# EAGLE schematic J007017_RGB_IR (EAGLE 7.7.0), part 2 of 2
## Sheet 6 of 6
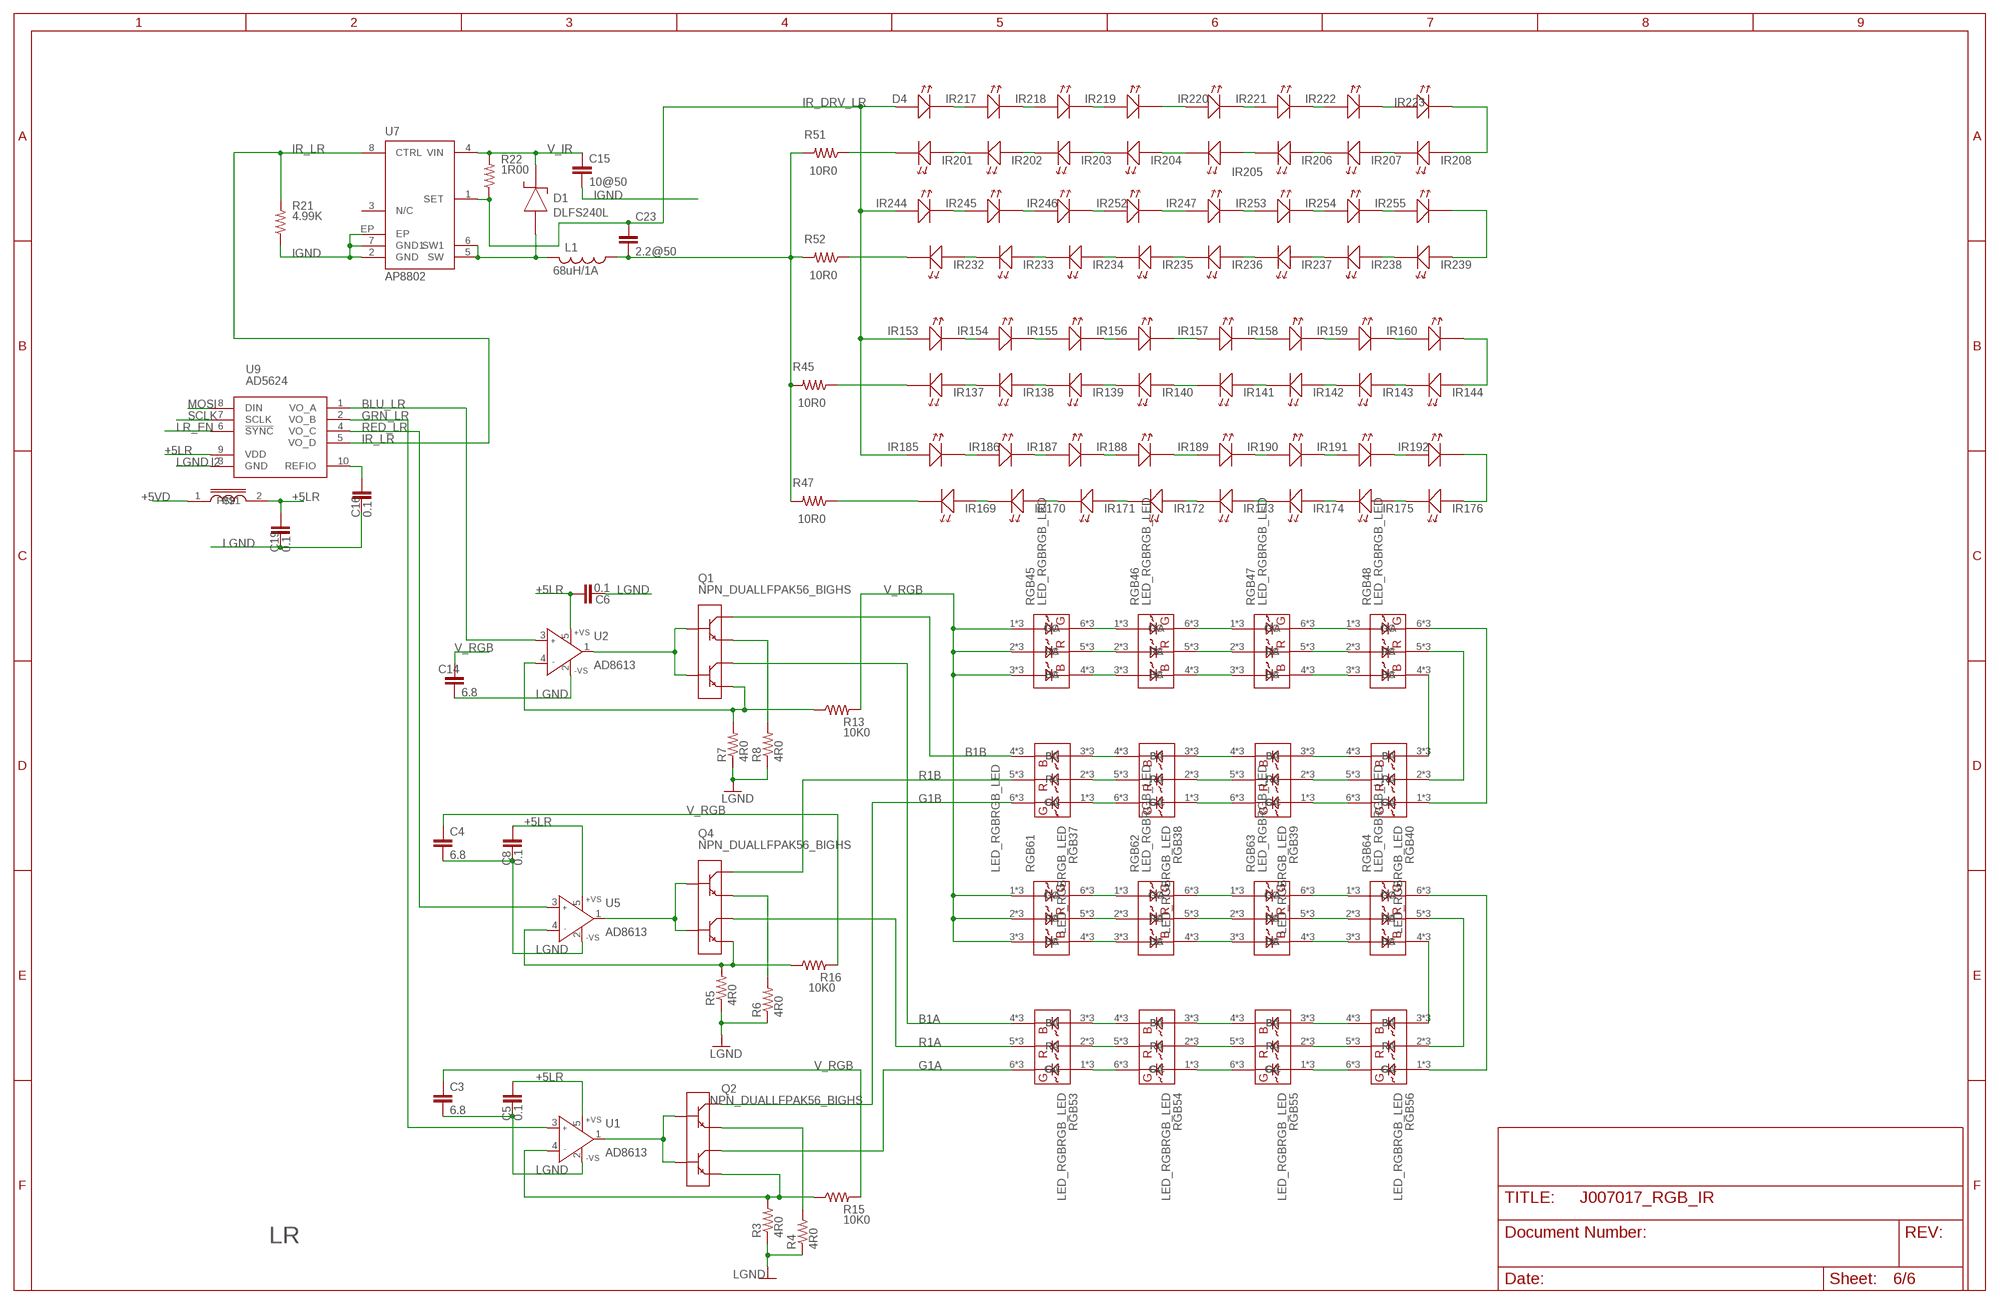
[diagram p3: schematic, sheet 6]

### Parts
C3  6.8  CAPS1210S  [1210S]
C4  6.8  CAPS1210S  [1210S]
C5  0.1  CAPS0603S  [0603S]
C6  0.1  CAPS0603S  [0603S]
C8  0.1  CAPS0603S  [0603S]
C14  6.8  CAPS1210S  [1210S]
C15  10@50  CAPS1210S  [1210S]
C16  0.1  CAPS0603S  [0603S]
C19  0.1  CAPS0603S  [0603S]
C23  2.2@50  CAPS1206S  [1206S]
D1  DLFS240L  DIODE_SCHOTTKYPWRDI-123  [PWRDI-123]
D4  LEDLED_SFH4050_HEAT  [LED_SFH4050_HEAT]
I2  INDUCTOR0805S  [0805S]
IR137  LEDLED_SFH4050  [LED_SFH4050]
IR138  LEDLED_SFH4050_HEAT  [LED_SFH4050_HEAT]
IR139  LEDLED_SFH4050_HEAT  [LED_SFH4050_HEAT]
IR140  LEDLED_SFH4050_HEAT  [LED_SFH4050_HEAT]
IR141  LEDLED_SFH4050_HEAT  [LED_SFH4050_HEAT]
IR142  LEDLED_SFH4050_HEAT  [LED_SFH4050_HEAT]
IR143  LEDLED_SFH4050_HEAT  [LED_SFH4050_HEAT]
IR144  LEDLED_SFH4050_HEAT  [LED_SFH4050_HEAT]
IR153  LEDLED_SFH4050_HEAT  [LED_SFH4050_HEAT]
IR154  LEDLED_SFH4050_A  [LED_SFH4045_HEAT_A]
IR155  LEDLED_SFH4050_HEAT  [LED_SFH4050_HEAT]
IR156  LEDLED_SFH4050_HEAT  [LED_SFH4050_HEAT]
IR157  LEDLED_SFH4050_HEAT  [LED_SFH4050_HEAT]
IR158  LEDLED_SFH4050_HEAT  [LED_SFH4050_HEAT]
IR159  LEDLED_SFH4050_HEAT  [LED_SFH4050_HEAT]
IR160  LEDLED_SFH4050_HEAT  [LED_SFH4050_HEAT]
IR169  LEDLED_SFH4050_HEAT  [LED_SFH4050_HEAT]
IR170  LEDLED_SFH4050_HEAT  [LED_SFH4050_HEAT]
IR171  LEDLED_SFH4050_HEAT  [LED_SFH4050_HEAT]
IR172  LEDLED_SFH4050_HEAT  [LED_SFH4050_HEAT]
IR173  LEDLED_SFH4050_HEAT  [LED_SFH4050_HEAT]
IR174  LEDLED_SFH4050_HEAT  [LED_SFH4050_HEAT]
IR175  LEDLED_SFH4050_HEAT  [LED_SFH4050_HEAT]
IR176  LEDLED_SFH4050_HEAT  [LED_SFH4050_HEAT]
IR185  LEDLED_SFH4050_HEAT  [LED_SFH4050_HEAT]
IR186  LEDLED_SFH4050_HEAT  [LED_SFH4050_HEAT]
IR187  LEDLED_SFH4050_HEAT  [LED_SFH4050_HEAT]
IR188  LEDLED_SFH4050_HEAT  [LED_SFH4050_HEAT]
IR189  LEDLED_SFH4050_HEAT  [LED_SFH4050_HEAT]
IR190  LEDLED_SFH4050_HEAT  [LED_SFH4050_HEAT]
IR191  LEDLED_SFH4050_HEAT  [LED_SFH4050_HEAT]
IR192  LEDLED_SFH4050_HEAT  [LED_SFH4050_HEAT]
IR201  LEDLED_SFH4050_HEAT  [LED_SFH4050_HEAT]
IR202  LEDLED_SFH4050_HEAT  [LED_SFH4050_HEAT]
IR203  LEDLED_SFH4050_HEAT  [LED_SFH4050_HEAT]
IR204  LEDLED_SFH4050_HEAT  [LED_SFH4050_HEAT]
IR205  LEDLED_SFH4050_HEAT  [LED_SFH4050_HEAT]
IR206  LEDLED_SFH4050_HEAT  [LED_SFH4050_HEAT]
IR207  LEDLED_SFH4050_HEAT  [LED_SFH4050_HEAT]
IR208  LEDLED_SFH4050_HEAT  [LED_SFH4050_HEAT]
IR217  LEDLED_SFH4050_HEAT  [LED_SFH4050_HEAT]
IR218  LEDLED_SFH4050_HEAT  [LED_SFH4050_HEAT]
IR219  LEDLED_SFH4050_HEAT  [LED_SFH4050_HEAT]
IR220  LEDLED_SFH4050_HEAT  [LED_SFH4050_HEAT]
IR221  LEDLED_SFH4050_HEAT  [LED_SFH4050_HEAT]
IR222  LEDLED_SFH4050_HEAT  [LED_SFH4050_HEAT]
IR223  LEDLED_SFH4050_HEAT  [LED_SFH4050_HEAT]
IR232  LEDLED_SFH4050_HEAT  [LED_SFH4050_HEAT]
IR233  LEDLED_SFH4050_HEAT  [LED_SFH4050_HEAT]
IR234  LEDLED_SFH4050_HEAT  [LED_SFH4050_HEAT]
IR235  LEDLED_SFH4050_HEAT  [LED_SFH4050_HEAT]
IR236  LEDLED_SFH4050_HEAT  [LED_SFH4050_HEAT]
IR237  LEDLED_SFH4050_HEAT  [LED_SFH4050_HEAT]
IR238  LEDLED_SFH4050_HEAT  [LED_SFH4050_HEAT]
IR239  LEDLED_SFH4050_HEAT  [LED_SFH4050_HEAT]
IR244  LEDLED_SFH4050_HEAT  [LED_SFH4050_HEAT]
IR245  LEDLED_SFH4050_HEAT  [LED_SFH4050_HEAT]
IR246  LEDLED_SFH4050_HEAT  [LED_SFH4050_HEAT]
IR247  LEDLED_SFH4050_HEAT  [LED_SFH4050_HEAT]
IR252  LEDLED_SFH4050_HEAT  [LED_SFH4050_HEAT]
IR253  LEDLED_SFH4050_HEAT  [LED_SFH4050_HEAT]
IR254  LEDLED_SFH4050_HEAT  [LED_SFH4050_HEAT]
IR255  LEDLED_SFH4050  [LED_SFH4050]
L1  68uH/1A  INDUCTOR_SMSRU8043  [SRU8043]
Q1  NPN_DUALLFPAK56_BIGHS  [LFPAK56_HS2]
Q2  NPN_DUALLFPAK56_BIGHS  [LFPAK56_HS2]
Q4  NPN_DUALLFPAK56_BIGHS  [LFPAK56_HS2]
R3  4R0  RESISTOR-POWER1812  [1812]
R4  4R0  RESISTOR-POWER1812  [1812]
R5  4R0  RESISTOR-POWER1812  [1812]
R6  4R0  RESISTOR-POWER1812  [1812]
R7  4R0  RESISTOR-POWER1812  [1812]
R8  4R0  RESISTOR-POWER1812  [1812]
R13  10K0  RESISTOR_SM1206S  [1206S]
R15  10K0  RESISTOR_SM1206S  [1206S]
R16  10K0  RESISTOR_SM1206S  [1206S]
R21  4.99K  RESISTOR_SM0805S  [0805S]
R22  1R00  RESISTOR_SM1206S  [1206S]
R45  10R0  RESISTOR_SM1206S  [1206S]
R47  10R0  RESISTOR_SM1206S  [1206S]
R51  10R0  RESISTOR_SM1206S  [1206S]
R52  10R0  RESISTOR_SM1206S  [1206S]
RGB37  LED_RGBRGB_LED  [OVSPRGB_HS_FIXED]
RGB38  LED_RGBRGB_LED  [OVSPRGB_HS_FIXED]
RGB39  LED_RGBRGB_LED  [OVSPRGB_HS_FIXED]
RGB40  LED_RGBRGB_LED  [OVSPRGB_HS_FIXED]
RGB45  LED_RGBRGB_LED  [OVSPRGB_HS_FIXED]
RGB46  LED_RGBRGB_LED  [OVSPRGB_HS_FIXED]
RGB47  LED_RGBRGB_LED  [OVSPRGB_HS_FIXED]
RGB48  LED_RGBRGB_LED  [OVSPRGB_HS_FIXED]
RGB53  LED_RGBRGB_LED  [OVSPRGB_HS_FIXED]
RGB54  LED_RGBRGB_LED  [OVSPRGB_HS_FIXED]
RGB55  LED_RGBRGB_LED  [OVSPRGB_HS_FIXED]
RGB56  LED_RGBRGB_LED  [OVSPRGB_HS_FIXED]
RGB61  LED_RGBRGB_LED  [OVSPRGB_HS_FIXED]
RGB62  LED_RGBRGB_LED  [OVSPRGB_HS_FIXED]
RGB63  LED_RGBRGB_LED  [OVSPRGB_HS_FIXED]
RGB64  LED_RGBRGB_LED  [OVSPRGB_HS_FIXED]
U1  AD8613  AD8065RT  [SOT23-5]
U2  AD8613  AD8065RT  [SOT23-5]
U5  AD8613  AD8065RT  [SOT23-5]
U7  AP8802  [SOIC8-EP]
U9  AD5624  AD56X4R  [MSOP10]

### Nets
+5LR: C5.1 C6.1 C8.1 C19.1 I2.2 U1.5(+VS) U2.5(+VS) U5.5(+VS) U9.9(VDD)
+5VD: I2.1 ; also sheet 1,3,4
B1A: Q1.5(C2) Q1.5A1(C2) Q1.5A(C2) Q1.5B(C2) Q1.5C1(C2) Q1.5C2(C2) Q1.5C(C2) Q1.6(C2) Q1.56(C2) Q1.56A(C2) Q1.56B(C2) RGB53.4(BC) RGB53.4A(BC) RGB53.4B(BC)
B1B: Q1.7(C1) Q1.8(C1) Q1.8A(C1) Q1.8B(C1) Q1.8C1(C1) Q1.8C2(C1) Q1.8C3(C1) Q1.8C(C1) Q1.78(C1) Q1.78A(C1) Q1.78B(C1) RGB37.4(BC) RGB37.4A(BC) RGB37.4B(BC)
BLU_LR: U2.3(IN+) U9.1(VO_A)
G1A: Q2.5(C2) Q2.5A1(C2) Q2.5A(C2) Q2.5B(C2) Q2.5C1(C2) Q2.5C2(C2) Q2.5C(C2) Q2.6(C2) Q2.56(C2) Q2.56A(C2) Q2.56B(C2) RGB53.6(GC) RGB53.6A(GC) RGB53.6B(GC)
G1B: Q2.7(C1) Q2.8(C1) Q2.8A(C1) Q2.8B(C1) Q2.8C1(C1) Q2.8C2(C1) Q2.8C3(C1) Q2.8C(C1) Q2.78(C1) Q2.78A(C1) Q2.78B(C1) RGB37.6(GC) RGB37.6A(GC) RGB37.6B(GC)
GRN_LR: U1.3(IN+) U9.2(VO_B)
IGND: C15.2 R21.1 U7.2(GND) U7.7(GND1) U7.EP ; also sheet 1,3,4
IR_DRV_LR: C23.1 D4.A D4.A1(A) IR153.A IR153.A1(A) IR185.A IR185.A1(A) IR244.A IR244.A1(A) R22.1 U7.1(SET)
IR_LR: R21.2 U7.8(CTRL) U9.5(VO_D)
IR_RET_UL3: C23.2 L1.1 R45.2 R47.2 R51.2 R52.2
LGND: C3.2 C4.2 C5.2 C6.2 C8.2 C14.2 C16.2 C19.2 R3.1 R4.1 R5.1 R6.1 R7.1 R8.1 U1.2(-VS) U2.2(-VS) U5.2(-VS) U9.3(GND) ; also sheet 1,3,4
LR_EN: U9.6(!SYNC) ; also sheet 1
MOSI: U9.8(DIN) ; also sheet 1,3,4
N$98: C16.1 U9.10(REFIO)
N$380: IR143.A IR143.A1(A) IR144.C1(K) IR144.C(K)
N$381: IR142.A IR142.A1(A) IR143.C1(K) IR143.C(K)
N$382: IR141.A IR141.A1(A) IR142.C1(K) IR142.C(K)
N$383: IR139.A IR139.A1(A) IR140.C1(K) IR140.C(K)
N$384: IR138.A IR138.A1(A) IR139.C1(K) IR139.C(K)
N$385: IR137.A IR138.C1(K) IR138.C(K)
N$386: IR153.C1(K) IR153.C(K) IR154.A IR154.A1(A)
N$387: IR154.C(K) IR155.A IR155.A1(A)
N$388: IR155.C1(K) IR155.C(K) IR156.A IR156.A1(A)
N$389: IR140.A IR140.A1(A) IR141.C1(K) IR141.C(K)
N$390: IR175.A IR175.A1(A) IR176.C1(K) IR176.C(K)
N$391: IR174.A IR174.A1(A) IR175.C1(K) IR175.C(K)
N$392: IR173.A IR173.A1(A) IR174.C1(K) IR174.C(K)
N$393: IR172.A IR172.A1(A) IR173.C1(K) IR173.C(K)
N$394: IR171.A IR171.A1(A) IR172.C1(K) IR172.C(K)
N$395: IR170.A IR170.A1(A) IR171.C1(K) IR171.C(K)
N$396: IR169.A IR169.A1(A) IR170.C1(K) IR170.C(K)
N$397: IR157.C1(K) IR157.C(K) IR158.A IR158.A1(A)
N$398: IR158.C1(K) IR158.C(K) IR159.A IR159.A1(A)
N$399: IR159.C1(K) IR159.C(K) IR160.A IR160.A1(A)
N$400: IR185.C1(K) IR185.C(K) IR186.A IR186.A1(A)
N$401: IR186.C1(K) IR186.C(K) IR187.A IR187.A1(A)
N$402: IR187.C1(K) IR187.C(K) IR188.A IR188.A1(A)
N$403: IR189.C1(K) IR189.C(K) IR190.A IR190.A1(A)
N$404: IR190.C1(K) IR190.C(K) IR191.A IR191.A1(A)
N$405: IR191.C1(K) IR191.C(K) IR192.A IR192.A1(A)
N$406: IR156.C1(K) IR156.C(K) IR157.A IR157.A1(A)
N$407: IR144.A IR144.A1(A) IR160.C1(K) IR160.C(K)
N$408: IR188.C1(K) IR188.C(K) IR189.A IR189.A1(A)
N$409: IR176.A IR176.A1(A) IR192.C1(K) IR192.C(K)
N$410: IR137.C(K) R45.1
N$411: IR169.C1(K) IR169.C(K) R47.1
N$412: IR207.A IR207.A1(A) IR208.C1(K) IR208.C(K)
N$413: IR206.A IR206.A1(A) IR207.C1(K) IR207.C(K)
N$414: IR205.A IR205.A1(A) IR206.C1(K) IR206.C(K)
N$415: IR203.A IR203.A1(A) IR204.C1(K) IR204.C(K)
N$416: IR202.A IR202.A1(A) IR203.C1(K) IR203.C(K)
N$417: IR201.A IR201.A1(A) IR202.C1(K) IR202.C(K)
N$418: D4.C1(K) D4.C(K) IR217.A IR217.A1(A)
N$419: IR217.C1(K) IR217.C(K) IR218.A IR218.A1(A)
N$420: IR218.C1(K) IR218.C(K) IR219.A IR219.A1(A)
N$421: IR204.A IR204.A1(A) IR205.C1(K) IR205.C(K)
N$422: IR238.A IR238.A1(A) IR239.C1(K) IR239.C(K)
N$423: IR237.A IR237.A1(A) IR238.C1(K) IR238.C(K)
N$424: IR236.A IR236.A1(A) IR237.C1(K) IR237.C(K)
N$425: IR235.A IR235.A1(A) IR236.C1(K) IR236.C(K)
N$426: IR234.A IR234.A1(A) IR235.C1(K) IR235.C(K)
N$427: IR233.A IR233.A1(A) IR234.C1(K) IR234.C(K)
N$428: IR232.A IR232.A1(A) IR233.C1(K) IR233.C(K)
N$429: IR220.C1(K) IR220.C(K) IR221.A IR221.A1(A)
N$430: IR221.C1(K) IR221.C(K) IR222.A IR222.A1(A)
N$431: IR222.C1(K) IR222.C(K) IR223.A IR223.A1(A)
N$432: IR244.C1(K) IR244.C(K) IR245.A IR245.A1(A)
N$433: IR245.C1(K) IR245.C(K) IR246.A IR246.A1(A)
N$434: IR246.C1(K) IR246.C(K) IR252.A IR252.A1(A)
N$435: IR247.C1(K) IR247.C(K) IR253.A IR253.A1(A)
N$436: IR253.C1(K) IR253.C(K) IR254.A IR254.A1(A)
N$437: IR254.C1(K) IR254.C(K) IR255.A
N$438: IR219.C1(K) IR219.C(K) IR220.A IR220.A1(A)
N$439: IR208.A IR208.A1(A) IR223.C1(K) IR223.C(K)
N$440: IR247.A IR247.A1(A) IR252.C1(K) IR252.C(K)
N$441: IR239.A IR239.A1(A) IR255.C(K)
N$442: IR201.C1(K) IR201.C(K) R51.1
N$443: IR232.C1(K) IR232.C(K) R52.1
N$444: Q1.3(E2) R7.2 R13.1 U2.4(IN-)
N$445: D1.A L1.2 U7.5(SW) U7.6(SW1)
N$446: Q4.3(E2) R5.2 R16.1 U5.4(IN-)
N$447: Q4.2(B1) Q4.4(B2) U5.1(OUT)
N$448: RGB45.6(GC) RGB45.6A(GC) RGB45.6B(GC) RGB46.1(GA) RGB46.1A(GA) RGB46.1B(GA)
N$449: RGB45.5(RC) RGB45.5A(RC) RGB45.5B(RC) RGB46.2(RA) RGB46.2A(RA) RGB46.2B(RA)
N$450: RGB45.4(BC) RGB45.4A(BC) RGB45.4B(BC) RGB46.3(BA) RGB46.3A(BA) RGB46.3B(BA)
N$451: RGB46.6(GC) RGB46.6A(GC) RGB46.6B(GC) RGB47.1(GA) RGB47.1A(GA) RGB47.1B(GA)
N$452: RGB46.5(RC) RGB46.5A(RC) RGB46.5B(RC) RGB47.2(RA) RGB47.2A(RA) RGB47.2B(RA)
N$453: RGB46.4(BC) RGB46.4A(BC) RGB46.4B(BC) RGB47.3(BA) RGB47.3A(BA) RGB47.3B(BA)
N$454: RGB47.6(GC) RGB47.6A(GC) RGB47.6B(GC) RGB48.1(GA) RGB48.1A(GA) RGB48.1B(GA)
N$455: RGB47.5(RC) RGB47.5A(RC) RGB47.5B(RC) RGB48.2(RA) RGB48.2A(RA) RGB48.2B(RA)
N$456: RGB47.4(BC) RGB47.4A(BC) RGB47.4B(BC) RGB48.3(BA) RGB48.3A(BA) RGB48.3B(BA)
N$457: RGB40.1(GA) RGB40.1A(GA) RGB40.1B(GA) RGB48.6(GC) RGB48.6A(GC) RGB48.6B(GC)
N$458: RGB40.2(RA) RGB40.2A(RA) RGB40.2B(RA) RGB48.5(RC) RGB48.5A(RC) RGB48.5B(RC)
N$459: RGB40.3(BA) RGB40.3A(BA) RGB40.3B(BA) RGB48.4(BC) RGB48.4A(BC) RGB48.4B(BC)
N$460: RGB39.1(GA) RGB39.1A(GA) RGB39.1B(GA) RGB40.6(GC) RGB40.6A(GC) RGB40.6B(GC)
N$461: RGB39.2(RA) RGB39.2A(RA) RGB39.2B(RA) RGB40.5(RC) RGB40.5A(RC) RGB40.5B(RC)
N$462: RGB39.3(BA) RGB39.3A(BA) RGB39.3B(BA) RGB40.4(BC) RGB40.4A(BC) RGB40.4B(BC)
N$463: RGB38.1(GA) RGB38.1A(GA) RGB38.1B(GA) RGB39.6(GC) RGB39.6A(GC) RGB39.6B(GC)
N$464: RGB38.2(RA) RGB38.2A(RA) RGB38.2B(RA) RGB39.5(RC) RGB39.5A(RC) RGB39.5B(RC)
N$465: RGB38.3(BA) RGB38.3A(BA) RGB38.3B(BA) RGB39.4(BC) RGB39.4A(BC) RGB39.4B(BC)
N$466: RGB37.1(GA) RGB37.1A(GA) RGB37.1B(GA) RGB38.6(GC) RGB38.6A(GC) RGB38.6B(GC)
N$467: RGB37.2(RA) RGB37.2A(RA) RGB37.2B(RA) RGB38.5(RC) RGB38.5A(RC) RGB38.5B(RC)
N$468: RGB37.3(BA) RGB37.3A(BA) RGB37.3B(BA) RGB38.4(BC) RGB38.4A(BC) RGB38.4B(BC)
N$470: Q2.3(E2) R3.2 R15.1 U1.4(IN-)
N$471: Q2.2(B1) Q2.4(B2) U1.1(OUT)
N$473: RGB61.6(GC) RGB61.6A(GC) RGB61.6B(GC) RGB62.1(GA) RGB62.1A(GA) RGB62.1B(GA)
N$474: RGB61.5(RC) RGB61.5A(RC) RGB61.5B(RC) RGB62.2(RA) RGB62.2A(RA) RGB62.2B(RA)
N$475: RGB61.4(BC) RGB61.4A(BC) RGB61.4B(BC) RGB62.3(BA) RGB62.3A(BA) RGB62.3B(BA)
N$476: RGB62.6(GC) RGB62.6A(GC) RGB62.6B(GC) RGB63.1(GA) RGB63.1A(GA) RGB63.1B(GA)
N$477: RGB62.5(RC) RGB62.5A(RC) RGB62.5B(RC) RGB63.2(RA) RGB63.2A(RA) RGB63.2B(RA)
N$478: RGB62.4(BC) RGB62.4A(BC) RGB62.4B(BC) RGB63.3(BA) RGB63.3A(BA) RGB63.3B(BA)
N$479: RGB63.6(GC) RGB63.6A(GC) RGB63.6B(GC) RGB64.1(GA) RGB64.1A(GA) RGB64.1B(GA)
N$480: RGB63.5(RC) RGB63.5A(RC) RGB63.5B(RC) RGB64.2(RA) RGB64.2A(RA) RGB64.2B(RA)
N$481: RGB63.4(BC) RGB63.4A(BC) RGB63.4B(BC) RGB64.3(BA) RGB64.3A(BA) RGB64.3B(BA)
N$482: RGB56.1(GA) RGB56.1A(GA) RGB56.1B(GA) RGB64.6(GC) RGB64.6A(GC) RGB64.6B(GC)
N$483: RGB56.2(RA) RGB56.2A(RA) RGB56.2B(RA) RGB64.5(RC) RGB64.5A(RC) RGB64.5B(RC)
N$484: RGB56.3(BA) RGB56.3A(BA) RGB56.3B(BA) RGB64.4(BC) RGB64.4A(BC) RGB64.4B(BC)
N$485: RGB55.1(GA) RGB55.1A(GA) RGB55.1B(GA) RGB56.6(GC) RGB56.6A(GC) RGB56.6B(GC)
N$486: RGB55.2(RA) RGB55.2A(RA) RGB55.2B(RA) RGB56.5(RC) RGB56.5A(RC) RGB56.5B(RC)
N$487: RGB55.3(BA) RGB55.3A(BA) RGB55.3B(BA) RGB56.4(BC) RGB56.4A(BC) RGB56.4B(BC)
N$488: RGB54.1(GA) RGB54.1A(GA) RGB54.1B(GA) RGB55.6(GC) RGB55.6A(GC) RGB55.6B(GC)
N$489: RGB54.2(RA) RGB54.2A(RA) RGB54.2B(RA) RGB55.5(RC) RGB55.5A(RC) RGB55.5B(RC)
N$490: RGB54.3(BA) RGB54.3A(BA) RGB54.3B(BA) RGB55.4(BC) RGB55.4A(BC) RGB55.4B(BC)
N$491: RGB53.1(GA) RGB53.1A(GA) RGB53.1B(GA) RGB54.6(GC) RGB54.6A(GC) RGB54.6B(GC)
N$492: RGB53.2(RA) RGB53.2A(RA) RGB53.2B(RA) RGB54.5(RC) RGB54.5A(RC) RGB54.5B(RC)
N$493: RGB53.3(BA) RGB53.3A(BA) RGB53.3B(BA) RGB54.4(BC) RGB54.4A(BC) RGB54.4B(BC)
N$494: Q1.2(B1) Q1.4(B2) U2.1(OUT)
N$496: Q1.1(E1) R8.2
N$497: Q4.1(E1) R6.2
N$500: Q2.1(E1) R4.2
R1A: Q4.5(C2) Q4.5A1(C2) Q4.5A(C2) Q4.5B(C2) Q4.5C1(C2) Q4.5C2(C2) Q4.5C(C2) Q4.6(C2) Q4.56(C2) Q4.56A(C2) Q4.56B(C2) RGB53.5(RC) RGB53.5A(RC) RGB53.5B(RC)
R1B: Q4.7(C1) Q4.8(C1) Q4.8A(C1) Q4.8B(C1) Q4.8C1(C1) Q4.8C2(C1) Q4.8C3(C1) Q4.8C(C1) Q4.78(C1) Q4.78A(C1) Q4.78B(C1) RGB37.5(RC) RGB37.5A(RC) RGB37.5B(RC)
RED_LR: U5.3(IN+) U9.4(VO_C)
SCLK: U9.7(SCLK) ; also sheet 1,3,4
V_IR: C15.1 D1.K R22.2 U7.4(VIN) ; also sheet 1,3,4
V_RGB: C3.1 C4.1 C14.1 R13.2 R15.2 R16.2 RGB45.1(GA) RGB45.1A(GA) RGB45.1B(GA) RGB45.2(RA) RGB45.2A(RA) RGB45.2B(RA) RGB45.3(BA) RGB45.3A(BA) RGB45.3B(BA) RGB61.1(GA) RGB61.1A(GA) RGB61.1B(GA) RGB61.2(RA) RGB61.2A(RA) RGB61.2B(RA) RGB61.3(BA) RGB61.3A(BA) RGB61.3B(BA) ; also sheet 1,3,4
Unconnected: U7.3(N/C)

### Notes on the sheet
- LR

## Library data of the parts
$$U$1-$$U$3 U$2 = adafruit:FIDUCIAL: For use by pick and place machines to calibrate the vision/machine, 1mm By microbuilder.eu
C1-C16 C19-C36 C38-C47 = STEVES_BU:CAPS
C17 C18 C37 = adafruit:CPOL-US: POLARIZED CAPACITOR, American symbol
D1-D3 D5 = STEVES_BU:DIODE_SCHOTTKY
D4 IR1-IR255 = STEVES_BU:LED
I1-I4 = STEVES:INDUCTOR
J1 J3 J4 J6 = STEVES_HOME:CON3
J2 = STEVES_BU:POWER_JACK_SHUNT
J5 = STEVES_BU:CON3
L1-L4 = STEVES_BU:INDUCTOR_SM
M1 = Teensy_3_Series_Board_v1.0:TEESNY3.2_MIN
Q1-Q12 = STEVES_BU:NPN_DUAL
R1-R12 R24 R26 R29 R30 R33 R35 R43 R44 R48 R49 R53 R57 = STEVES_BU:RESISTOR-POWER
R13-R23 R25 R27 R28 R31 R32 R34 R36-R42 R45-R47 R50-R52 R54-R56 R58-R62 = STEVES_BU:RESISTOR_SM
RGB1-RGB64 = STEVES_BU:LED_RGB
SH1 SH2 = STEVES_BU:JUMPER
U1-U6 U13 U14 U16 U18 U20 U21 = analog-devices:AD8065: High Performance, 145 MHz FastFET Op Amps Source: http://www.analog.com/static/imported-files/data_sheets/AD8065_8066.pdf; MF: ALTERA CORPORATION; MPN: AD8065ARTZ-REEL7; OC_FARNELL: 1464845; OC_NEWARK: 59K6316
U7 U10 U17 U22 = STEVES_BU:AP8802
U8 U9 U15 U19 = STEVES_BU:AD56X4R
U11 = 74xx-little-us:74*1G3157: Single-Pole, Double-Throw Analog Switch Source: http://focus.ti.com/lit/ds/symlink/sn74lvc1g3157.pdf
U12 = STEVES_BU:LM26